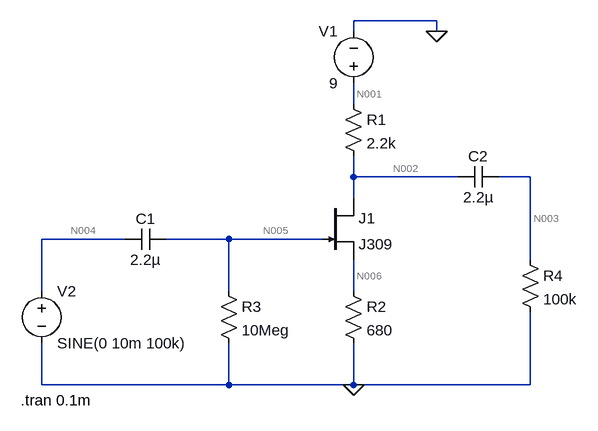
[diagram p0: schematic Draft.asc]
Draft.asc, the LTspice schematic file:
Version 4.1
SHEET 1 880 680
WIRE 352 -128 224 -128
WIRE 224 -112 224 -128
WIRE 352 -112 352 -128
WIRE 224 0 224 -32
WIRE 224 112 224 80
WIRE 384 112 224 112
WIRE 496 112 448 112
WIRE 224 144 224 112
WIRE -128 208 -256 208
WIRE 32 208 -64 208
WIRE 176 208 32 208
WIRE 496 240 496 112
WIRE -256 288 -256 208
WIRE 32 288 32 208
WIRE 224 288 224 240
WIRE -256 432 -256 368
WIRE 32 432 32 368
WIRE 32 432 -256 432
WIRE 224 432 224 368
WIRE 224 432 32 432
WIRE 496 432 496 320
WIRE 496 432 224 432
FLAG 224 432 0
FLAG 352 -112 0
SYMBOL njf 176 144 R0
SYMATTR InstName J1
SYMATTR Value J309
SYMBOL res 208 -16 R0
SYMATTR InstName R1
SYMATTR Value 2.2k
SYMBOL res 208 272 R0
SYMATTR InstName R2
SYMATTR Value 680
SYMBOL res 16 272 R0
SYMATTR InstName R3
SYMATTR Value 10Meg
SYMBOL cap -64 192 R90
WINDOW 0 0 32 VBottom 2
WINDOW 3 32 32 VTop 2
SYMATTR InstName C1
SYMATTR Value 2.2µ
SYMBOL cap 384 128 R270
WINDOW 0 32 32 VTop 2
WINDOW 3 0 32 VBottom 2
SYMATTR InstName C2
SYMATTR Value 2.2µ
SYMBOL voltage 224 -16 R180
WINDOW 0 24 96 Left 2
WINDOW 3 24 16 Left 2
WINDOW 123 0 0 Left 0
WINDOW 39 0 0 Left 0
SYMATTR InstName V1
SYMATTR Value 9
SYMBOL voltage -256 272 R0
WINDOW 123 0 0 Left 0
WINDOW 39 0 0 Left 0
SYMATTR InstName V2
SYMATTR Value SINE(0 10m 100k)
SYMBOL res 480 224 R0
SYMATTR InstName R4
SYMATTR Value 100k
TEXT -288 456 Left 2 !.tran 0.1m

The netlist it stands for:
* Draft.asc
J1 N002 N005 N006 J309
R1 N001 N002 2.2k
R2 N006 0 680
R3 N005 0 10Meg
C1 N005 N004 2.2µ
C2 N002 N003 2.2µ
V1 N001 0 9
V2 N004 0 SINE(0 10m 100k)
R4 N003 0 100k
.model NJF NJF
.model PJF PJF
.lib standard.jft
.tran 0.1m
.backanno
.end

* Results of the author's LTspice run, read from the files saved beside the schematic
* Operating Point, zero values left out:
*   V(n005) = 131.8 µV
*   V(n001) = 9 V
*   V(n002) = 4.408 V
*   V(n006) = 1.419 V
*   I(R2) = 2.087 mA
*   Id(J1) = 2.087 mA
*   Ig(J1) = -13.18 pA
*   Is(J1) = -2.087 mA
*   I(R3) = 13.18 pA
*   I(V1) = -2.087 mA
*   I(R1) = 2.087 mA
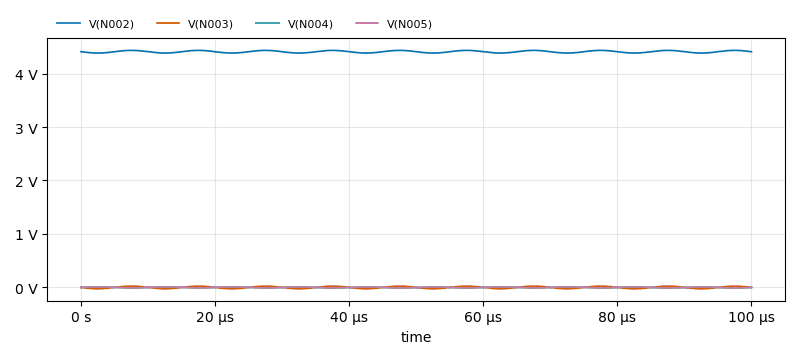
[diagram p1: Transient Analysis of Draft.asc, plotted from the saved traces]
* Transient Analysis, 1 run:
*   V(N002): min 4.383 V, max 4.433 V, average 4.408 V, rms 4.408 V, last 4.408 V
*   V(N003): min -25.32 mV, max 25.31 mV, average -2.398 µV, rms 17.92 mV, last 142.5 µV
*   V(N004): min -10 mV, max 10 mV, average -40.78 nV, rms 7.08 mV, last 0 V
*   V(N005): min -9.868 mV, max 10.13 mV, average 131.7 µV, rms 7.081 mV, last 131.8 µV